# Altium schematic sheet Mouse_Project.SchDoc
size A4; SheetNumber: 1; SheetTotal: 1
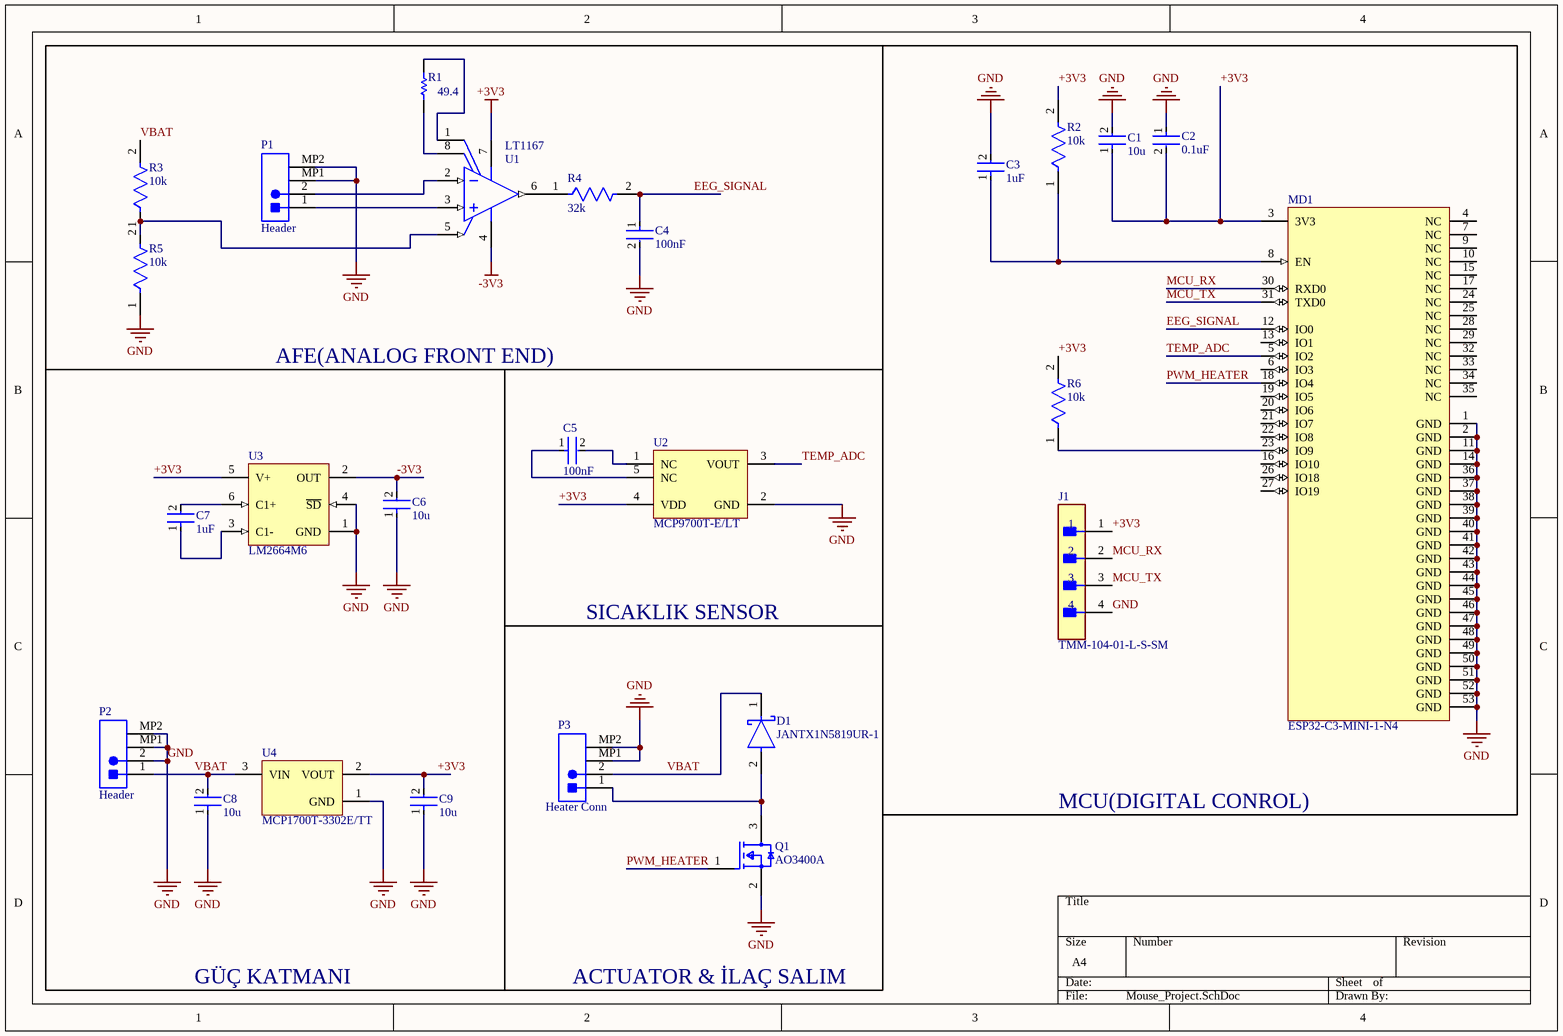
[diagram p0: Mouse_Project.SchDoc]

## Parts
C1  10u  [FP-CC0603-DC-IPC_A]
C2  0.1uF  [FP-C0603C-CF-MFG]
C3  1uF  [FP-CL10-IPC_C]
C4  100nF  [FP-CL21-IPC_B]
C5  100nF  [FP-CL21-IPC_B]
C6  10u  [FP-CC0603-DC-IPC_A]
C7  1uF  [FP-CL10-IPC_C]
C8  10u  [FP-CC0603-DC-IPC_A]
C9  10u  [FP-CC0603-DC-IPC_A]
D1  JANTX1N5819UR-1  [FP-DO-213AB-MFG]
J1  TMM-104-01-L-S-SM  [FP-TMM-104-01-L-S-SM-MFG]
MD1  ESP32-C3-MINI-1-N4  [FP-ESP32-C3-MINI-1-N4-MFG]
P1  Header  [MOLX-53261-0271_V]
P2  Header  [MOLX-53261-0271_V]
P3  Heater Conn  [MOLX-53261-0271_V]
Q1  AO3400A  [FP-SOT23-MFG]
R1  49.4  [RESC1608X55X30ML15T15]
R2  10k  [FP-RT0805-MFG]
R3  10k  [FP-RT0805-MFG]
R4  32k  [FP-RT0805-MFG]
R5  10k  [FP-RT0805-MFG]
R6  10k  [FP-RT0805-MFG]
U1  LT1167  [LT-S8-8_M]
U2  MCP9700T-E/LT  [SC70-LT5_M]
U3  LM2664M6  [DBV0006A_N]
U4  MCP1700T-3302E/TT  [SOT-23-TT3_N]

## Nets
+3V3: C1.1 C2.2 C9.2 J1.1 MD1.3(3V3) R2.2 R6.2 U1.7(+VS) U2.4(VDD) U3.5(V+) U4.2(VOUT)
-3V3: C6.2 U1.4(-VS) U3.2(OUT)
GND: C1.2 C2.1 C3.2 C4.2 C6.1 C8.1 C9.1 J1.4 MD1.1(GND) MD1.2(GND) MD1.11(GND) MD1.14(GND) MD1.36(GND) MD1.37(GND) MD1.38(GND) MD1.39(GND) MD1.40(GND) MD1.41(GND) MD1.42(GND) MD1.43(GND) MD1.44(GND) MD1.45(GND) MD1.46(GND) MD1.47(GND) MD1.48(GND) MD1.49(GND) MD1.50(GND) MD1.51(GND) MD1.52(GND) MD1.53(GND) P1.MP1 P1.MP2 P2.2 P2.MP1 P2.MP2 P3.MP1 P3.MP2 Q1.2(S) R5.1 U2.2(GND) U3.1(GND) U3.4(~{SD}) U4.1(GND)
EEG_SIGNAL: C4.1 MD1.12(IO0) R4.2
MCU_RX: J1.2 MD1.30(RXD0)
MCU_TX: J1.3 MD1.31(TXD0)
PWM_HEATER: MD1.18(IO4) Q1.1(G)
TEMP_ADC: MD1.5(IO2) U2.3(VOUT)
VBAT: C8.2 D1.1(C) P2.1 P3.2 R3.2 U4.3(VIN)
NetC3_1: C3.1 MD1.8(EN) R2.1
NetC5_1: C5.1 U2.5(NC)
NetC5_2: C5.2 U2.1(NC)
NetC7_1: C7.1 U3.3(C1-)
NetC7_2: C7.2 U3.6(C1+)
NetD1_2: D1.2(A) P3.1 Q1.3(D)
NetMD1_23: MD1.23(IO9) R6.1
NetP1_1: P1.1 U1.3(+IN)
NetP1_2: P1.2 U1.2(-IN)
NetR1_1: R1.1 U1.8(RG)
NetR1_2: R1.2 U1.1(RG)
NetR3_1: R3.1 R5.2 U1.5(REF)
NetR4_1: R4.1 U1.6(OUTPUT)

Not connected (* = marked no-connect by the designer): MD1 4(NC) 6(IO3) 7(NC) 9(NC) 10(NC) 13(IO1) 15(NC) 16(IO10) 17(NC) 19(IO5) 20(IO6) 21(IO7) 22(IO8) 24(NC) 25(NC) 26(IO18) 27(IO19) 28(NC) 29(NC) 32(NC) 33(NC) 34(NC) 35(NC)

## Notes on the sheet
- AFE(ANALOG FRONT END)
- SICAKLIK SENSOR
- MCU(DIGITAL CONROL)
- GÜÇ KATMANI
- ACTUATOR & İLAÇ SALIM

## Library data of the parts
C1 C6 C8 C9 = CMP-03422-001507-1: CAP CER 10UF 10V X5R 0603; Tolerance: 10%; Case/Package: 0603; Length: 0.063inch; Capacitance: 10uF; Dielectric: X5R; Mount: Surface Mount; Case Code (Metric): 1608; Depth: 0.8mm; Voltage Rating (DC): 10V; Voltage Rating: 10V; Lead Free: Lead Free; Resistor Type: Ceramic; Packaging: Tape and Reel; Max Operating Temperature: 85°C; Termination: SMD/SMT; Min Operating Temperature: -55°C; Weight: 7.1E-05oz; Thickness: 0.035inch; Case Code (Imperial): 0603; Package Quantity: 4000; Halogen Free: Halogen Free; RoHS Compliant: Yes; Width: 0.031inch
C2 = CMP-2006-03061-2: CAP CER 0.1UF 50V X7R 0603; Manufacturer: KEMET; Manufacturer Part Number: C0603C104K5RACTU; Tolerance: 0.1; Temperature Coefficient: 30ppm/°C; Material: Ceramic; Automotive Grade: Grade 1; Value: 0.10 μF; Temperature: -55°C to +125°C; RoHS: TRUE; Temperature Range High: +125°C; Lead Free: Yes; Octopart: https://octopart.com/c0603c104k5ractu-kemet-139244; Digikey Description: CAP CER 0.1UF 50V X7R 0603; Category: Cap; Package: C0603C-CF; ComponentLink2Description: Datasheet; Temperature Range Low: -55°C; Device Class L1: Passive Components; Voltage Rating: 50 V; Automotive: Yes; Device Class L3: Ceramic Capacitors; ComponentLink2URL: https://api.kemet.com/component-edge/download/datasheet/C0603C100J5GACAUTO.pdf; Capacitance: 0.10 μF; Device Class L2: Capacitors; Temperature Characteristic: X7R; Height: 0.87mm
C3 C7 = CMP-13271-004127-1: Cap Ceramic 1uF 25V X5R ±10% Pad SMD 0603 +85°C T/R; Height: 0.8mm; Capacitance: 1uF; Depth: 0.8mm; Package Quantity: 1; Mount: Surface Mount; Contact Plating: Tin; Voltage Rating: 25V; Dielectric: X5R; Packaging: Tape and Reel; Material: Ceramic; Case Code (Metric): 1608; Length: 1.6mm; Voltage: 25V; Min Operating Temperature: -55°C; Width: 0.031inch; Tolerance: 10%; Case/Package: 0603; Radiation Hardening: No; Case Code (Imperial): 0603; Thickness: 0.035inch; Lead Free: Lead Free; Max Operating Temperature: 85°C; Voltage Rating (DC): 25V
C4 C5 = CMP-13271-004863-1: CL21 Series 0805 100nF 25V -20/+80% Tolerance Y5V Multilayer Ceramic Chip Capacitor
D1 = CMP-06358-000027-1: DIODE SCHOTTKY 45V 1A DO213AB
J1 = CMP-02766-001552-1: CONN HEADER SMD 4POS 2MM; Max Current Rating: 3.9A; Max Voltage Rating (AC): 500V; Number of Contacts: 4; Gender: Male; Max Operating Temperature: 125°C; Length: 8mm; RoHS Compliant: Yes; Depth: 1.97mm; Housing Color: Black; Pitch: 2mm; Orientation: Straight; Termination: Solder; Contact Plating: Gold; Lead Free: Lead Free; REACH SVHC: No SVHC; Min Operating Temperature: -55°C; Number of Rows: 1; Packaging: Bulk; Housing Material: Polymer; Radiation Hardening: No; Contact Material: Bronze
MD1 = CMP-10700-116589975-1: Multiprotocol Modules SMD module, ESP32-C3FN4, PCB antenna, -40 C +85 C; Max Frequency: 2.484GHz; Min Supply Voltage: 3V; Current - Transmitting: 350mA; Interface: SPI; Data Rate: 150Mbps; Max Supply Voltage: 3.6V; Number of GPIO: 13; Current - Receiving: 84mA; Min Operating Temperature: -40°C; Height: 2.55mm; Ambient Temperature Range High: 85°C; Max Operating Temperature: 85°C
P1-P3 = CMP-2000-05633-1: PicoBlade(TM) Header, Right Angle, -40 to 85 degC, 2-Pin SMD, RoHS, Tape and Reel; Current - Max: 1A; Brand: Molex; Voltage Rating: 125V; Number of Positions: 2; Pitch: 1.25mm; Package Version: Rev. H, 11/2014; Factory Pack Quantity: 1000; Datasheet URL: http://www.molex.com/webdocs/datasheets/pdf/en-us/0532610271_PCB_HEADERS.pdf; Datasheet Version: 03/2016; Housing Material: Thermoplastic; RoHS: Details; Product Type: Headers; Number of Rows: 1; Termination Style: SMD; Mounting Technology: SurfaceMount; Number of Positions / Contacts: 2; Package URL: http://www.molex.com/pdm_docs/sd/532610271_sd.pdf; Mounting Angle: Right; Mounting Style: SMD/SMT; Manufacturer: Molex; Product Category: 1.25mmConnectors; Tradename: PicoBlade; Voltage - Max: 125V; Manufacturer URL: http://www.molex.com/; Series: 53261; Package Description: 2-Leads Header, Pitch 1.25 mm, Mated Height 3.4 mm; Package Reference: 53261-0271; Current Rating: 1A; Contact Plating: Tin; Contact Material: PhosphorBronze; Type: Shrouded; Packaging: Reel
Q1 = CMP-83955-000006-1: MOSFET N-CH 30V 5.7A SOT23; Input Capacitance: 630pF; Number of Elements: 1; Rds On Max: 26.5mR; Max Power Dissipation: 1.4W; Gate to Source Voltage (Vgs): 12V; Min Operating Temperature: -55°C; Lead Free: Lead Free; Number of Pins: 3; Drain to Source Voltage (Vdss): 30V; Case/Package: SOT-23; Mount: Surface Mount; Continuous Drain Current (ID): 5.7A; Radiation Hardening: No; Packaging: Tape and Reel; Max Operating Temperature: 150°C; Power Dissipation: 1.4W
R1 = CMP-2000-00538-1: Manufacturer: Panasonic; Part Number: ERJ-3EKF49R9V
R2 R3 R5 R6 = CMP-03412-025153-1: RES SMD 10.2K OHM 0.5% 1/8W 0805; Manufacturer: Yageo; Manufacturer Part Number: RT0805DRD0710K2L; Resistance: 10.2KΩ; Temperature Coefficient: 25 ppm/°C; Value: 10.2KΩ; Power Rating: 0.125W; Voltage Rating: 150V; Tolerance: 0.01; Temperature: -55°C to +155°C; RoHS: TRUE; Device Class L3: Chip SMD Resistors; Footprint Url: http://www.yageo.com/exep/pages/download/literatures/PYu-R_Mount_10.pdf; Device Class L1: Passive Components; Octopart: https://octopart.com/rt0805drd0710k2l-yageo-1441674; Package: RT0805; Digikey Description: RES SMD 10.2K OHM 0.5% 1/8W 0805; Ipc Land Pattern Name: RESC200125X50; Lead Free: Yes; Automotive: No; Series: RT; Temperature Range High: +155°C; Device Class L2: Resistors; ComponentLink2URL: http://www.yageo.com/documents/recent/PYu-RT_1-to-0.01_RoHS_L_9.pdf; ComponentLink2Description: Datasheet; Category: Res; Temperature Range Low: -55°C; Height: 0.6mm; Composition: Thin Film
R4 = CMP-03412-016239-1: RES SMD 332K OHM 0.1% 1/8W 0805; Manufacturer: Yageo; Manufacturer Part Number: RT0805BRE07332KL; Resistance: 332KΩ; Power Rating: 0.125W; Value: 332KΩ; Tolerance: 0.0025; Temperature Coefficient: 50 ppm/°C; Voltage Rating: 150V; Lead Free: Yes; Footprint Url: http://www.yageo.com/exep/pages/download/literatures/PYu-R_Mount_10.pdf; Composition: Thin Film; Temperature Range Low: -55°C; Temperature Range High: +155°C; Octopart: https://octopart.com/rt0805bre07332kl-yageo-1228961; Device Class L1: Passive Components; Digikey Description: RES SMD 332K OHM 0.1% 1/8W 0805; Category: Res; ComponentLink2URL: http://www.yageo.com/documents/recent/PYu-RT_1-to-0.01_RoHS_L_9.pdf; RoHS: TRUE; Series: RT; Height: 0.6mm; Automotive: No; Package: RT0805; ComponentLink2Description: Datasheet; Device Class L3: Chip SMD Resistors; Temperature: -55°C to +155°C; Device Class L2: Resistors; Ipc Land Pattern Name: RESC200125X50
U1 = CMP-0359-03162-2: Single Channel, Precision Operational Amplifier, Low Bias Current IA, 1 MHz Typical GBW, 1.2 V/us Typical SR, 4.6 to 40 V, 8-Pin SOIC (S8-8), Industrial, Pb-Free; PartNumber: LT1167AIS8#PBF; Manufacturer: Linear Technology; Is (mA) Typical: 0.9; Channels (#): 1; Vos (mV) Typical: 0.015; Vs Min (V): 4.6; SR (V/us) Typical: 1.2; Vs Max (V): 40; ComponentLink1Description: Manufacturer URL; ComponentLink2Description: Datasheet; RevisionNote: URLs updated; PackageDescription: 8-Pin Plastic Small Outline, Body 4.9 x 3.9 mm, Pitch 1.27 mm; ComponentLink2URL: http://cds.linear.com/docs/en/datasheet/1167fc.pdf; Linear Technology Part Number: LT1167; DatasheetVersion: Rev. C; ComponentLink3Description: Package Specification; ComponentLink3URL: http://cds.linear.com/docs/en/packaging/05081610_G_SO8.pdf; PackageVersion: Rev G; PackageReference: LT-S8-8; Mounting Technology: Surface Mount; ComponentLink1URL: http://www.linear.com/; GBW (MHz) Typical: 1; Type: IA; RoHS: Pb-Free
U2 = CMP-0192-00174-1: Low-Power Linear Active Thermistor IC, 5-Pin SC-70, Extended Temperature, Tape and Reel; PackageDescription: 5-Lead Plastic Small Outline Transistor (LT) [SC70]; DatasheetVersion: revE, Apr-2009; PackageVersion: revBB, Aug-2009; PackageReference: SC70-LT5; Code_IPC: SOT353-5
U3 = CMP-0065-00095-3: Switched Capacitor Voltage Converter, 6-pin SOT-23; Manufacturer: Texas Instruments; CompType: Switch Caps; PackageTopMarking: S03A*XTT; PowerWise: N; PackageDescription: Molded SOT-23, .115 x .063 x .040in Body, 6 Lead, .0375in in Pitch; Code_IPC: SOT26A-6; PinCount: 6; PackageReference: DBV0006A; ComponentLink1URL: http://www.ti.com/general/docs/lit/getliterature.tsp?genericPartNumber=LM2664&fileType=pdf; Code_JEDEC: MO-178-AB; ComponentLink1Description: Datasheet URL; RoHS: N
U4 = CMP-0136-00791-1: Low Quiescent Current LDO, 3-Pin SOT-23, Extended Temperature, Tape and Reel; PackageVersion: revBB, Aug-2009; Code_IPC: SOT23-3; PackageReference: SOT-23-TT3; DatasheetVersion: revB, Feb-2007; PackageDescription: 3-Lead Plastic Small Outline Transistor (TT) [SOT-23]